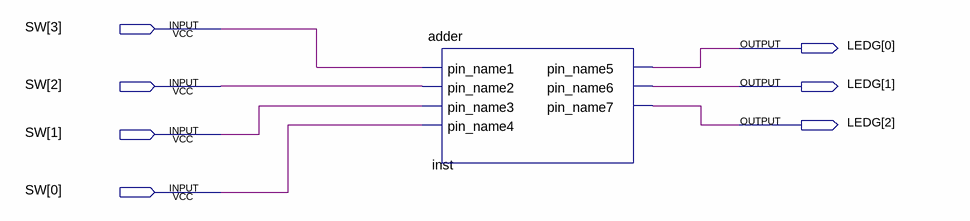
[diagram p0: schematic sheet]
// Quartus schematic lab2.bdf as structural Verilog: 1 symbols, 7 pins
module lab2 (
  input  [3:0] SW,
  output [2:0] LEDG
);

  adder inst (
    .pin_name1(SW[3]), .pin_name2(SW[2]), .pin_name3(SW[1]), .pin_name4(SW[0]), .pin_name5(LEDG[0]),
    .pin_name6(LEDG[1]), .pin_name7(LEDG[2]));
endmodule
